# Altium schematic sheet Vertap_UserInterface.SchDoc: UserInterface
size A4; Author: Taim Al-Dabbagh; DrawnBy: Taim Al-Dabbagh; Revision: v1; SheetNumber: 6; SheetTotal: 6
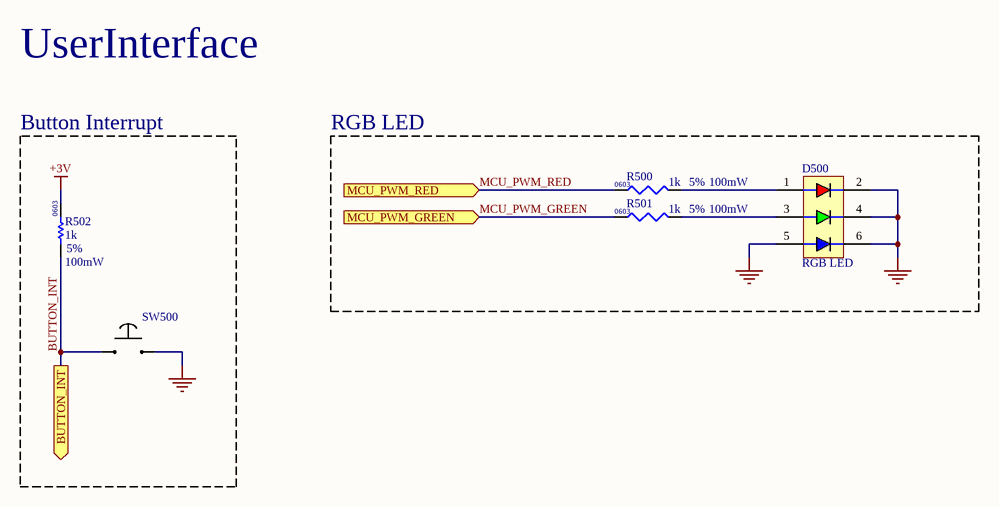
[diagram p0: Vertap_UserInterface.SchDoc]

## Parts
D500  RGB LED  [ASMB-TTF0-0A20B]
R500  1k  [RES_0603_YAGEO]
R501  1k  [RES_0603_YAGEO]
R502  1k  [RESC1608X55X25LL10T15]
SW500  LS38G2F-T  [LS38G2F-T]  (value not drawn)

## Blocks framed on the sheet
Button Interrupt: R502 SW500
RGB LED: D500 R500 R501

## Ports
BUTTON_INT (out), MCU_PWM_GREEN (in), MCU_PWM_RED (in)

## Nets
+3V: R502.2
GND: D500.2(RED-) D500.4(GREEN-) D500.5(BLUE+) D500.6(BLUE-) SW500.2
BUTTON_INT: R502.1 SW500.1 ; port BUTTON_INT
MCU_PWM_GREEN: R501.1 ; port MCU_PWM_GREEN
MCU_PWM_RED: R500.1 ; port MCU_PWM_RED
NetD500_1: D500.1(RED+) R500.2
NetD500_3: D500.3(GREEN+) R501.2

## Notes on the sheet
- UserInterface
- (near R502) 0603
- (near R500) 0603
- (near R501) 0603
- 5%
- 100mW
- (near R502) 100mW
- (near R502) 5%

## Library data of the parts
D500 = ASMB-TTF0-0A20B: Red, Green, Blue (RGB) 621nm Red, 522nm Green, 468nm Blue LED Indication - Discrete 2.1V Red, 2.9V Green, 2.9V Blue 4-SMD, J-Lead; Supplier 1: Newark; Supplier Part Number 1: 57AC0504
R500 R501 = RES_0603_1K: RES 1K OHM 5% 1/10W 0603; Manufacturer: YAGEO; Manufacturer Part Number: RC0603JR-101KL; Supplier 1: Arrow Electronics; Supplier Part Number 1: RC0603JR-101KL
R502 = CMP-2000-04305-1: Manufacturer: Yageo; Part Number: RC0603JR-101KL
SW500 = LS38G2F-T: TOP-PRESS TACTILE SWITCH; Supplier 1: Digi-Key; Supplier Part Number 1: 1642-LS38G2F-TCT-ND